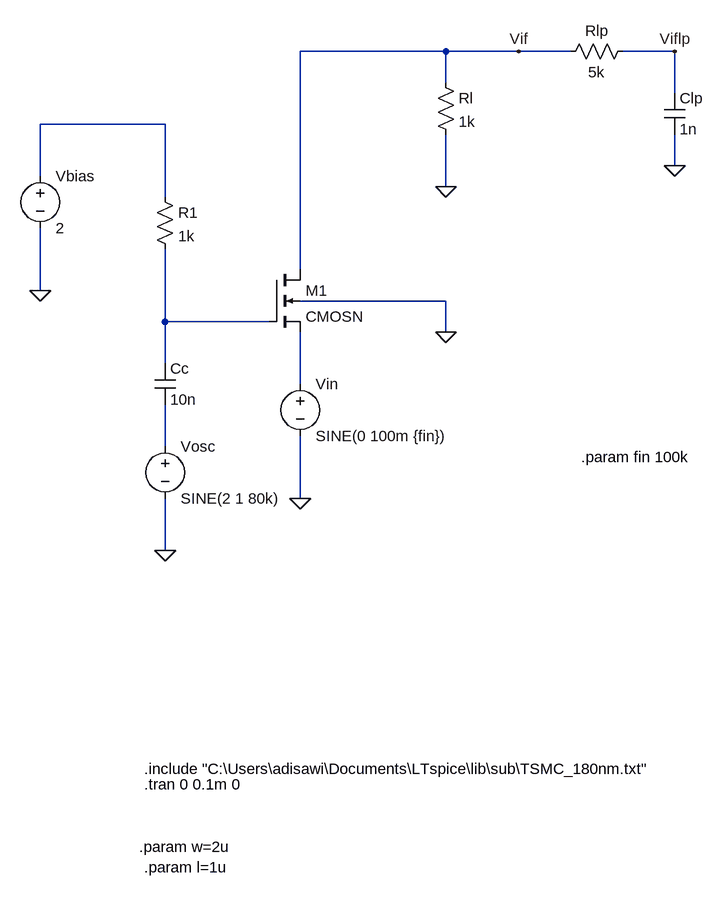
[diagram p0: schematic projmixer.asc]
projmixer.asc, the LTspice schematic file:
Version 4
SHEET 1 880 1064
WIRE -96 -208 -320 -208
WIRE 16 -208 -96 -208
WIRE 96 -208 16 -208
WIRE 256 -208 176 -208
WIRE -96 -160 -96 -208
WIRE 256 -144 256 -208
WIRE -528 -96 -720 -96
WIRE 256 -32 256 -80
WIRE -720 -16 -720 -96
WIRE -96 0 -96 -80
WIRE -528 16 -528 -96
WIRE -320 128 -320 -208
WIRE -720 160 -720 64
WIRE -96 176 -320 176
WIRE -528 208 -528 96
WIRE -368 208 -528 208
WIRE -96 224 -96 176
WIRE -528 272 -528 208
WIRE -320 304 -320 224
WIRE -528 400 -528 336
WIRE -320 480 -320 384
WIRE -528 560 -528 480
FLAG -96 224 0
FLAG -320 480 0
FLAG -96 0 0
FLAG 16 -208 Vif
FLAG -528 560 0
FLAG -720 160 0
FLAG 256 -32 0
FLAG 256 -208 Viflp
SYMBOL nmos4 -368 128 R0
SYMATTR InstName M1
SYMATTR Value CMOSN
SYMATTR Value2 l={l} w={w} ad={2.5*w*l} as={2.5*w*l} pd={5*l+2*w} ps={5*l+2*w}
SYMBOL voltage -320 288 R0
WINDOW 123 0 0 Left 0
WINDOW 39 0 0 Left 0
SYMATTR InstName Vin
SYMATTR Value SINE(0 100m {fin})
SYMBOL res -112 -176 R0
SYMATTR InstName Rl
SYMATTR Value 1k
SYMBOL cap -544 272 R0
SYMATTR InstName Cc
SYMATTR Value 10n
SYMBOL voltage -528 384 R0
WINDOW 123 0 0 Left 0
WINDOW 39 0 0 Left 0
SYMATTR InstName Vosc
SYMATTR Value SINE(2 1 80k)
SYMBOL res -544 0 R0
SYMATTR InstName R1
SYMATTR Value 1k
SYMBOL voltage -720 -32 R0
SYMATTR InstName Vbias
SYMATTR Value 2
SYMBOL res 192 -224 R90
WINDOW 0 0 56 VBottom 2
WINDOW 3 32 56 VTop 2
SYMATTR InstName Rlp
SYMATTR Value 5k
SYMBOL cap 240 -144 R0
SYMATTR InstName Clp
SYMATTR Value 1n
TEXT -560 896 Left 2 !.include "C:\\Users\\adisawi\\Documents\\LTspice\\lib\\sub\\TSMC_180nm.txt"
TEXT -560 920 Left 2 !.tran 0 0.1m 0
TEXT -568 1016 Left 2 !.param w=2u
TEXT -560 1048 Left 2 !.param l=1u
TEXT 112 416 Left 2 !.param fin 100k

The netlist it stands for:
* projmixer.asc
M1 Vif N002 N003 0 CMOSN l={l} w={w} ad={2.5*w*l} as={2.5*w*l} pd={5*l+2*w} ps={5*l+2*w}
Vin N003 0 SINE(0 100m {fin})
Rl Vif 0 1k
Cc N002 N004 10n
Vosc N004 0 SINE(2 1 80k)
R1 N001 N002 1k
Vbias N001 0 2
Rlp Viflp Vif 5k
Clp Viflp 0 1n
.model NMOS NMOS
.model PMOS PMOS
.lib standard.mos
.include "C:\Users\adisawi\Documents\LTspice\lib\sub\TSMC_180nm.txt"
.tran 0 0.1m 0
.param w=2u
.param l=1u
.param fin 100k
.backanno
.end